# Altium schematic sheet tsc.1r.SchDoc
size A3
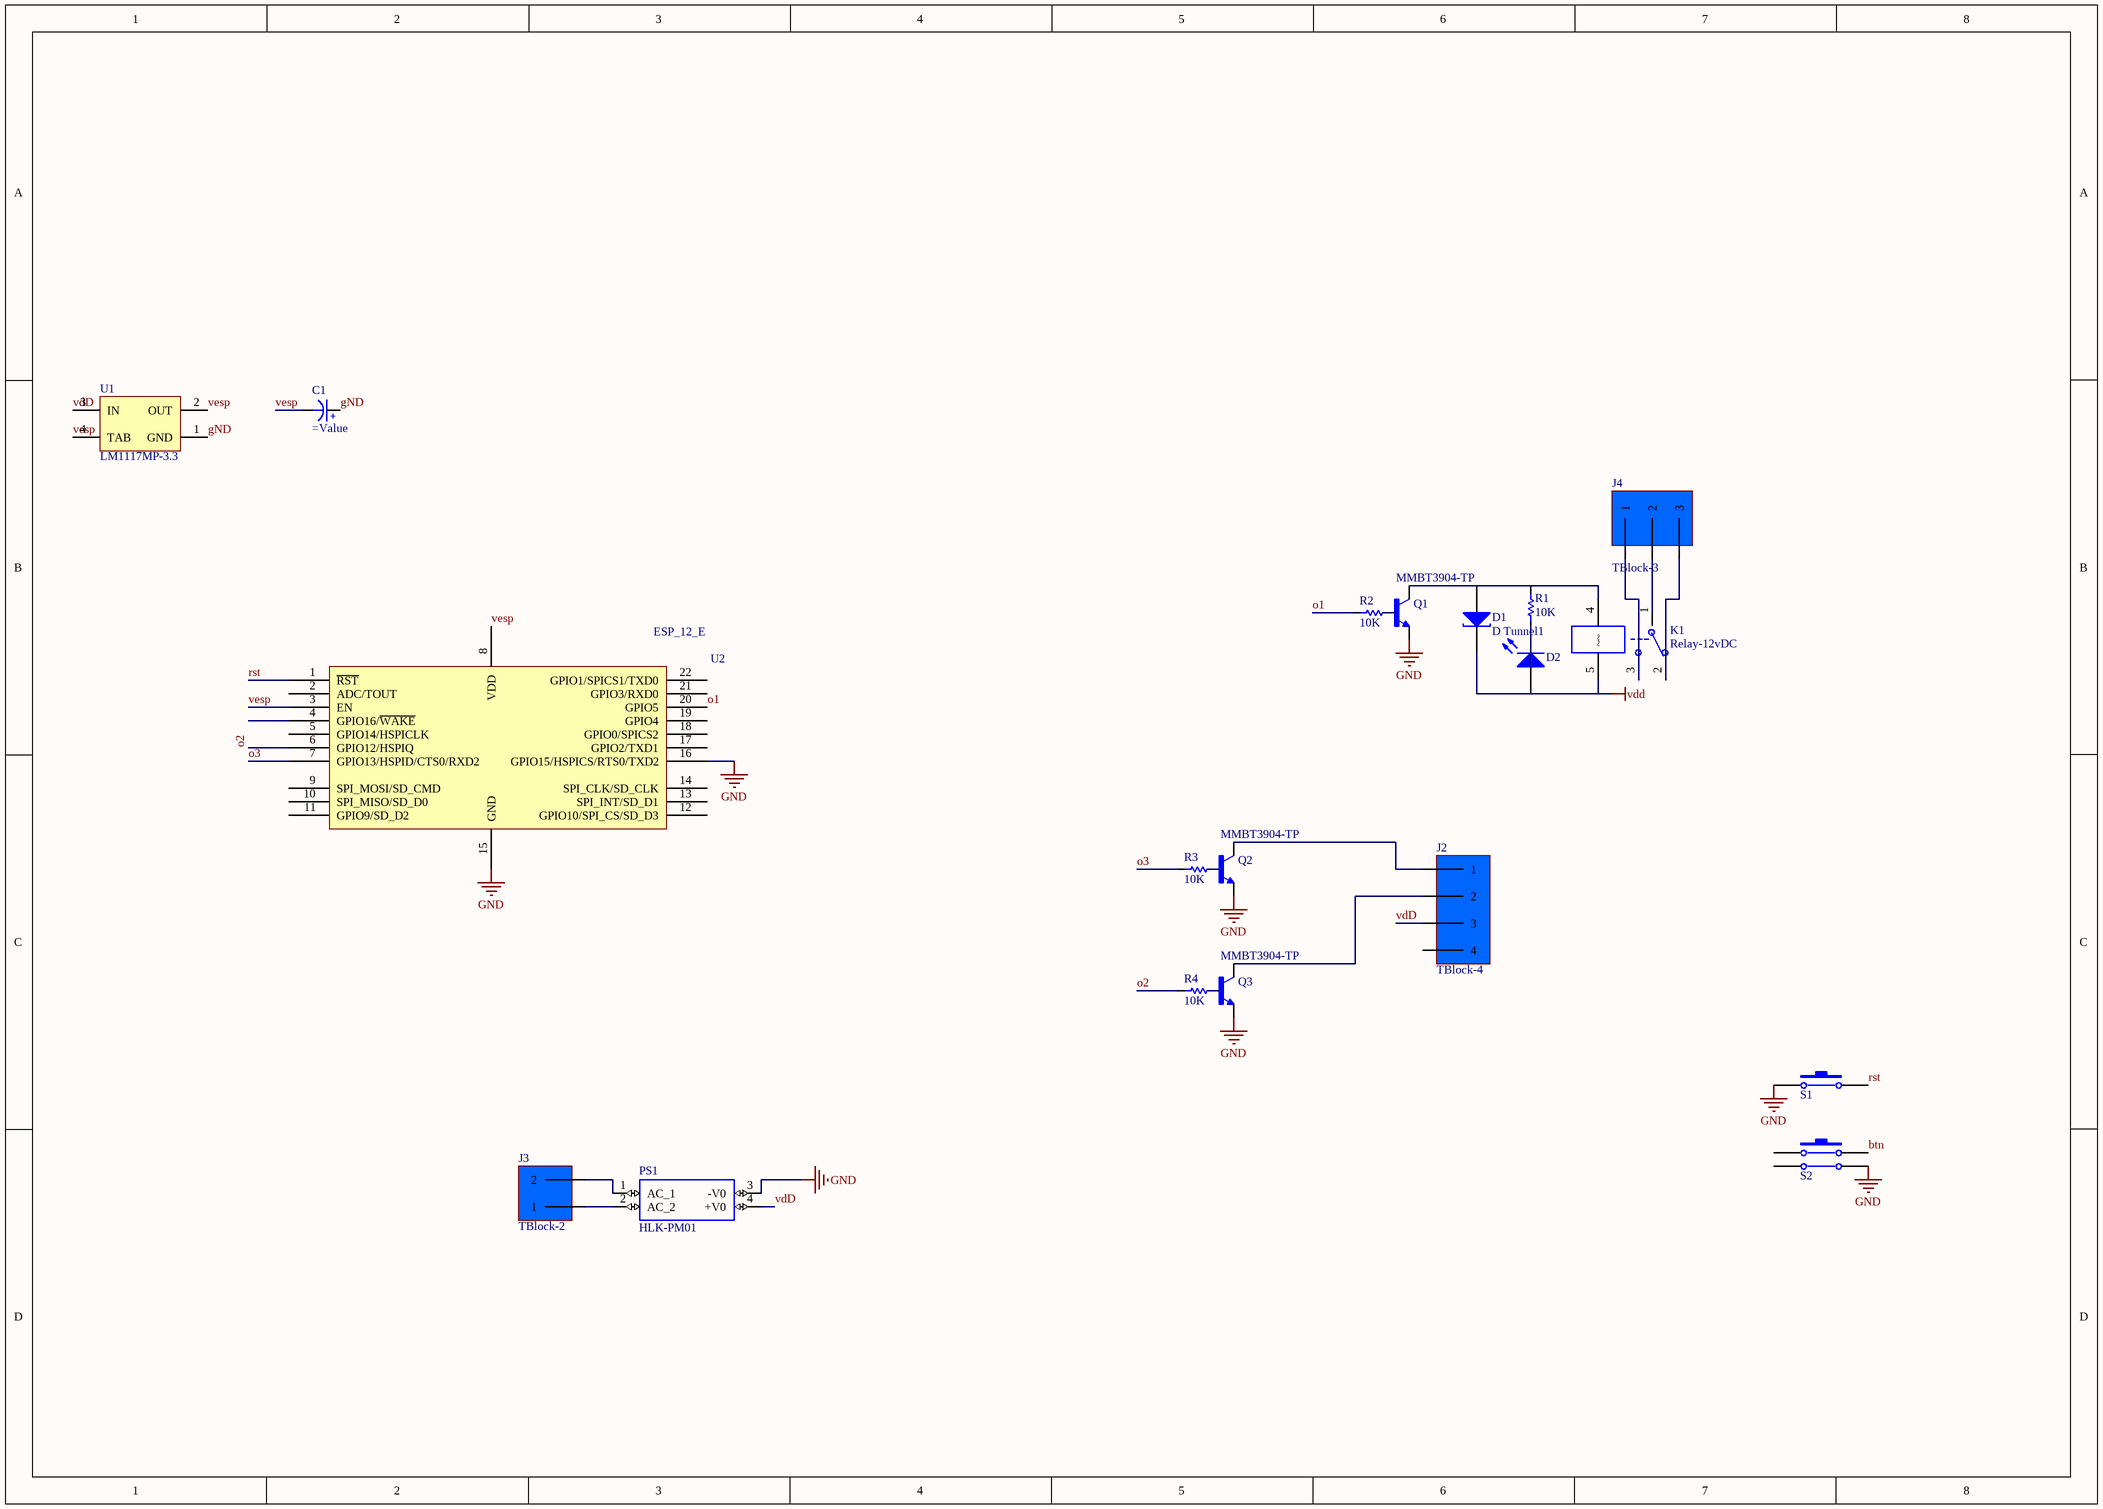
[diagram p0: tsc.1r.SchDoc]

## Parts
C1  (no value)  [ELEC-CAP-RAD10-20]
D1  D Tunnel1  [3.2X1.6X1.1]
D2  LED 3mm  [LED-3mm]  (value not drawn)
J2  TBlock-4  [KF300-4 PIN]
J3  TBlock-2  [KF300-2 PIN]
J4  TBlock-3  [KF300-3 PIN]
K1  Relay-12vDC  [Relays]
PS1  HLK-PM01  [HLKPM01]
Q1  MMBT3904-TP  [SOT23-3]
Q2  MMBT3904-TP  [SOT23-3]
Q3  MMBT3904-TP  [SOT23-3]
R1  10K  [RES 1206 (3216X08L)]
R2  10K  [RES 1206 (3216X08L)]
R3  10K  [RES 1206 (3216X08L)]
R4  10K  [RES 1206 (3216X08L)]
S1  PB-2pin  [PB-2pin]  (value not drawn)
S2  PUSH BUTTON DOUBLE  [PUSH BUTTON]  (value not drawn)
U1  LM1117MP-3.3  [MP04A_N]
U2  ESP_12_E  [ESP_12_E]

## Nets
gND: C1.2(+) PS1.3(-V0) Q1.2(E) Q2.2(E) Q3.2(E) S1.1 S2.4 U1.1(GND) U2.15(GND) U2.16(GPIO15/HSPICS/RTS0/TXD2)
vdD: D1.2(K) D2.1(A) J2.3 K1.5 PS1.4(+V0) U1.3(IN)
btn: S2.2
o1: R2.1 U2.20(GPIO5)
o2: R4.1 U2.6(GPIO12/HSPIQ)
o3: R3.1 U2.7(GPIO13/HSPID/CTS0/RXD2)
rst: S1.2 U2.1(~{RST})
vesp: C1.1(-) U1.2(OUT) U1.4(TAB) U2.3(EN) U2.8(VDD)
NetD1_1: D1.1(A) K1.4 Q1.3(C) R1.2
NetD2_2: D2.2(K) R1.1
NetJ2_1: J2.1 Q2.3(C)
NetJ2_2: J2.2 Q3.3(C)
NetJ3_1: J3.1 PS1.2(AC_2)
NetJ3_2: J3.2 PS1.1(AC_1)
NetJ4_1: J4.1 K1.3(NO)
NetJ4_2: J4.2 K1.1(COM)
NetJ4_3: J4.3 K1.2(NC)
NetQ1_1: Q1.1(B) R2.2
NetQ2_1: Q2.1(B) R3.2
NetQ3_1: Q3.1(B) R4.2

Not connected (* = marked no-connect by the designer): J2 4; S2 1 3; U2 2(ADC/TOUT) 4(GPIO16/~{WAKE}) 5(GPIO14/HSPICLK) 9(SPI_MOSI/SD_CMD) 10(SPI_MISO/SD_D0) 11(GPIO9/SD_D2) 12(GPIO10/SPI_CS/SD_D3) 13(SPI_INT/SD_D1) 14(SPI_CLK/SD_CLK) 17(GPIO2/TXD1) 18(GPIO0/SPICS2) 19(GPIO4) 21(GPIO3/RXD0) 22(GPIO1/SPICS1/TXD0)

## Library data of the parts
C1 = Capacitor Electrolytic: Electrolytic Capacitor
D1 = D Tunnel1: Tunnel Diode - RLC Model; Published: 8-Jun-2000; LatestRevisionDate: 17-Jul-2002; LatestRevisionNote: Re-released for DXP Platform.; PackageVersion: Feb-2002; PackageReference: 3.2X1.6X1.1; Publisher: Altium Limited; PackageDescription: SM LED; 2 Flat Leads
D2 = LED 3mm: Typical LED; Designer: Seyed Mohsen Ghasemian; Published: 02/04/2012; PackageReference: LED; Publisher: www.picpars.com; PackageDescription: LED; 2 Leads
K1 = Relay-05vDC: Relay-05vDC-240AC 5A; Designer: Seyed Mohsen Ghasemain; ComponentLinkURL: www.picpars.com
PS1 = HLK-PM01: <b>Ultra-compact power module</b><p> Source: <a href="https://datasheet.lcsc.com/szlcsc/1906201102_HI-LINK-HLK-PM03_C209904.pdf"> Datasheet </a>; Package: Package Analog Devices; MF: Hi-link; Availability: Unavailable; Value: *; MP: hlk-pm01; Price: None; SnapEDA_Link: https://www.snapeda.com/parts/hlk-pm01/Hi-link/view-part/2875605/?ref=snap
Q1-Q3 = MMBT3904-TP: Bipolar _BJT_ Transistor NPN 40V 200mA 300MHz 350mW Surface Mount SOT-23; MF: Micro Commercial; Value: *; MP: MMBT3904-TP; Package: SOT-23 Micro Commercial; Price: None; Availability: Unavailable; SnapEDA_Link: https://www.snapeda.com/parts/MMBT3904-TP/Micro%20Commercial/view-part/805928/?ref=snap
R1-R4 = Resistor: Tolerance: 5%; Power: 1/4 W; Value: 10K
S1 = PB-2pin: Switch; E-mail: picpars@gmail.com; Designer: Seyed Mohsen Ghasemian; Publisher: www.picpars.com; WEB: www.picpars.com
S2 = PUSH BUTTON DOUBLE: Switch
U1 = LM1117MP-3.3: 800mA Low-Dropout Linear Regulator; Manufacturer: National Semiconductor; CompType: LDO IC; PackageTopMarking: XYTT*N05A; PowerWise: N; Published: 4-Dec-2008; DatasheetVersion: Apr-2006; PackageVersion: revB, Apr-2003; PackageReference: MP04A; Publisher: Altium Limited; PackageDescription: Molded SOT-223, 6.50 x 3.56 x 1.6mm Body, 4 Lead, 2.3mm Pitch; PartNumber: LM1117MP-3.3; RoHS: O; PinCount: 4; DigiKeyPartNumber: LM1117MP-3.3CT-ND; Code_JEDEC: TO-261-AA; Code_IPC: SOT223-4; ComponentLink1Description: LM1117 Datasheet; ComponentLink1URL: http://www.national.com/ds/LM/LM1117.pdf; ComponentLink2Description: LM1117 Web Page; ComponentLink2URL: http://www.national.com/pf/LM/LM1117.html; ComponentLink3Description: MP04A Package Page; ComponentLink3URL: http://www.national.com/packaging/folders/mp04a.html
U2 = ESP_12_E: ESP-12 Wi-Fi Module by AI-Thinker; IC: ESP8266-EX; Vendor: Ai-thinker